# Altium project RECEPTOR_AIS.PrjPcb
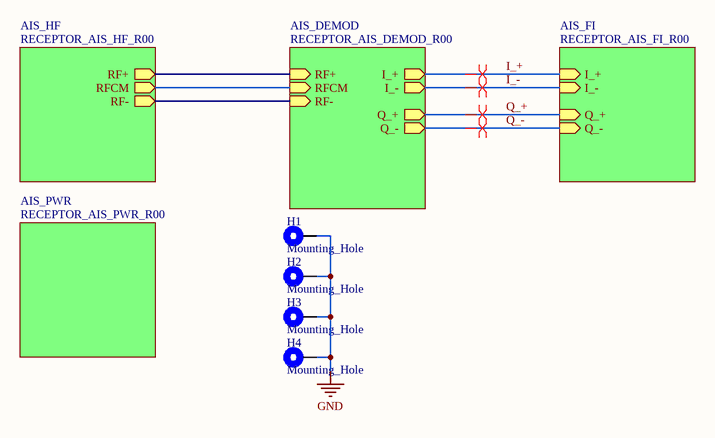
[diagram p0: RECEPTOR_AIS_BLK_R00.SchDoc]
5 sheets, 124 parts. Net scope: hierarchical (ports join the sheet entries above them; power ports are global).
Board file: Receptor_AIS_R00.PcbDoc
Sheets:
  RECEPTOR_AIS_BLK_R00.SchDoc
    AIS_HF = RECEPTOR_AIS_HF_R00.SchDoc
    AIS_DEMOD = RECEPTOR_AIS_DEMOD_R00.SchDoc
    AIS_FI = RECEPTOR_AIS_FI_R00.SchDoc
    AIS_PWR = RECEPTOR_AIS_PWR_R00.SchDoc

## Sheet RECEPTOR_AIS_BLK_R00.SchDoc
size A4; SheetNumber: 1; SheetTotal: 5

### Parts
H1  Mounting_Hole  [Mounting_Hole_M2]  (no BOM)
H2  Mounting_Hole  [Mounting_Hole_M2]  (no BOM)
H3  Mounting_Hole  [Mounting_Hole_M2]  (no BOM)
H4  Mounting_Hole  [Mounting_Hole_M2]  (no BOM)

### Sub-sheets
AIS_DEMOD = RECEPTOR_AIS_DEMOD_R00: RF- (in), RF+ (in), Q_+ (out), Q_- (out), RFCM (in), I_- (out), I_+ (out)
AIS_FI = RECEPTOR_AIS_FI_R00: I_+ (in), I_- (in), Q_+ (in), Q_- (in)
AIS_HF = RECEPTOR_AIS_HF_R00: RF+ (out), RF- (out), RFCM (out)
AIS_PWR = RECEPTOR_AIS_PWR_R00: no entries

### Nets
GND: H1.1 H2.1 H3.1 H4.1
I_+: sheet AIS_DEMOD/I_+, sheet AIS_FI/I_+
I_-: sheet AIS_DEMOD/I_-, sheet AIS_FI/I_-
Q_+: sheet AIS_DEMOD/Q_+, sheet AIS_FI/Q_+
Q_-: sheet AIS_DEMOD/Q_-, sheet AIS_FI/Q_-
RF+: sheet AIS_HF/RF+, sheet AIS_DEMOD/RF+
RF-: sheet AIS_HF/RF-, sheet AIS_DEMOD/RF-
RFCM: sheet AIS_HF/RFCM, sheet AIS_DEMOD/RFCM

### Layout directives
differential pair: I_+, I_-, Q_+, Q_-

## Sheet RECEPTOR_AIS_HF_R00.SchDoc
size A4; SheetNumber: 2; SheetTotal: 5
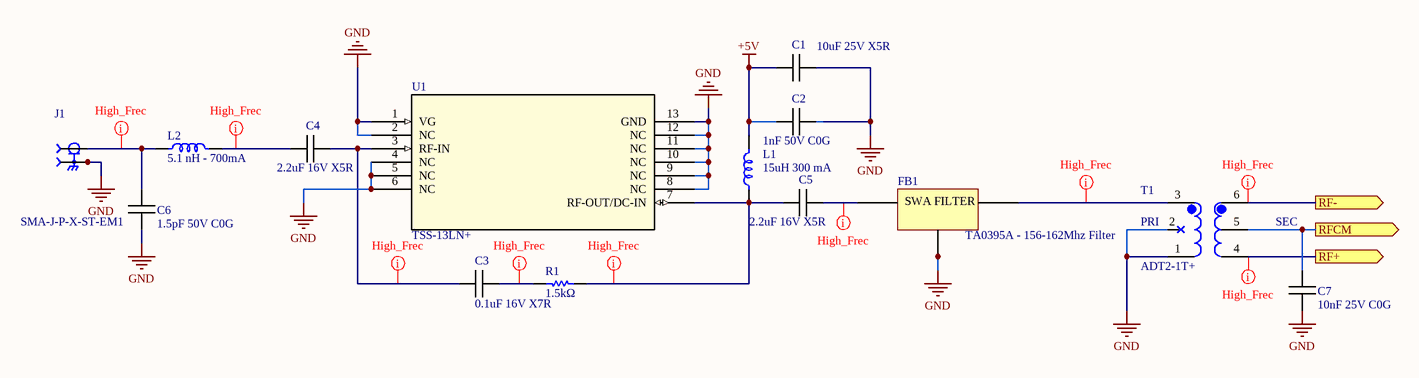
[diagram p1: RECEPTOR_AIS_HF_R00.SchDoc]

### Parts
C1  10uF 25V X5R  [C_0805]
C2  1nF 50V C0G  [C_0603]
C3  0.1uF 16V X7R  [C_0603]
C4  2.2uF 16V X5R  [C_0603]
C5  2.2uF 16V X5R  [C_0603]
C6  1.5pF 50V C0G  [C_0603]
C7  10nF 25V C0G  [C_0603]
FB1  TA0395A - 156-162Mhz Filter  [TA0395A]
J1  SMA-J-P-X-ST-EM1  [CONN_SMA-J-P-H-ST-EM1_SAI]
L1  15uH 300 mA  [IND_LQH32DN150K53L]
L2  5.1 nH - 700mA  [L_0603]
R1  1.5kΩ  [R_0603]
T1  ADT2-1T+  [CD542_MNC]
U1  TSS-13LN+  [TSS-13LN+]

### Ports
RF+ (out, see RECEPTOR_AIS_BLK_R00[2A], RECEPTOR_AIS_DEMOD_R00[2A]), RF- (out, see RECEPTOR_AIS_BLK_R00[2B], RECEPTOR_AIS_DEMOD_R00[2A]), RFCM (out, see RECEPTOR_AIS_BLK_R00[2B], RECEPTOR_AIS_DEMOD_R00[2A])

### Nets
+5V: C1.2 C2.1 L1.2
GND: C1.1 C2.2 C6.1 C7.1 FB1.1 FB1.3 FB1.4 FB1.5 FB1.6 FB1.8 FB1.9 FB1.10 J1.2 J1.3 T1.1 T1.2 U1.1(VG) U1.2(NC) U1.4(NC) U1.5(NC) U1.6(NC) U1.8(NC) U1.9(NC) U1.10(NC) U1.11(NC) U1.12(NC) U1.13(GND)
RF+: T1.4 ; port RF+
RF-: T1.6 ; port RF-
RFCM: C7.2 T1.5 ; port RFCM
NetC3_1: C3.1 C4.2 U1.3(RF-IN)
NetC3_2: C3.2 R1.2
NetC4_1: C4.1 L2.2
NetC5_1: C5.1 L1.1 R1.1 U1.7(RF-OUT/DC-IN)
NetC5_2: C5.2 FB1.7
NetC6_2: C6.2 J1.1 L2.1
NetFB1_2: FB1.2 T1.3

### Layout directives
net class RF_50Ohm: NetC3_1, NetC3_2, NetC4_1, NetC5_1, NetC5_2, NetC6_2, NetFB1_2, RF+, RF-

### Notes on the sheet
- (in symbol ADT2-1T+) PRI; SEC
- (in symbol TA0395A) SWA FILTER

### Library data of the parts
C1 = Capacitor NP: 10 µF ±10% 25V Ceramic Capacitor X5R 0805 (2012 Metric)
C2 = Capacitor NP: 1000 pF ±5% 50V Ceramic Capacitor C0G, NP0 0603 (1608 Metric)
C3 = Capacitor NP: 0.1 µF ±10% 16V Ceramic Capacitor X7R 0603 (1608 Metric)
C4 C5 = Capacitor NP: 2.2 µF ±10% 16V Ceramic Capacitor X5R 0603 (1608 Metric)
C6 = Capacitor NP: 1.5 pF ±0.25pF 50V Ceramic Capacitor C0G, NP0 0603 (1608 Metric)
C7 = Capacitor NP: 10000 pF ±5% 25V Ceramic Capacitor C0G, NP0 0603 (1608 Metric)
FB1 = TA0395A: 159.1625MHz Frequency Wireless RF SAW Filter (Surface Acoustic Wave) 3.8dB 5.725MHz Bandwidth 10-SMD, No Lead
J1 = SMA-J-P-X-ST-EM1: SMA Connector Jack, Female Socket 50 Ohms Board Edge, Cutout; Surface Mount Solder; MF: Samtec; MP: SMA-J-P-H-ST-EM3; SnapEDA_Link: https://www.snapeda.com/parts/SMA-J-P-H-ST-EM3/Samtec+Inc./view-part/?ref=snap; Package: None; Value: *; Check_prices: https://www.snapeda.com/parts/SMA-J-P-H-ST-EM3/Samtec+Inc./view-part/?ref=eda
L1 = IND: LQH32DN150K53L - 15 µH Unshielded Drum Core, Wirewound Inductor 300 mA 754mOhm Max Nonstandard
L2 = IND: LQW18AS5N1J00D - 5.1 nH Unshielded Wirewound Inductor 700 mA 140mOhm Max 0603 (1608 Metric)
R1 = Res1: 1.5 kΩ ±1% 0.1W, 1/10W Chip Resistor 0603 (1608 Metric) Moisture Resistant Thick Film
T1 = ADT2-1T+: Description; Manufacturer_Name: Mini Circuits; Type: Balun; Copyright: Copyright (C) 2026 Ultra Librarian. All rights reserved.; Manufacturer_Part_Number: ADT2-1T+; RefDes: RefDes
U1 = TSS-13LN+: Description; Manufacturer_Name: Mini Circuits; Copyright: Copyright (C) 2025 Ultra Librarian. All rights reserved.; Manufacturer_Part_Number: TSS-13LN+; RefDes: RefDes; Type: Type

## Sheet RECEPTOR_AIS_DEMOD_R00.SchDoc
size A4; SheetNumber: 3; SheetTotal: 5
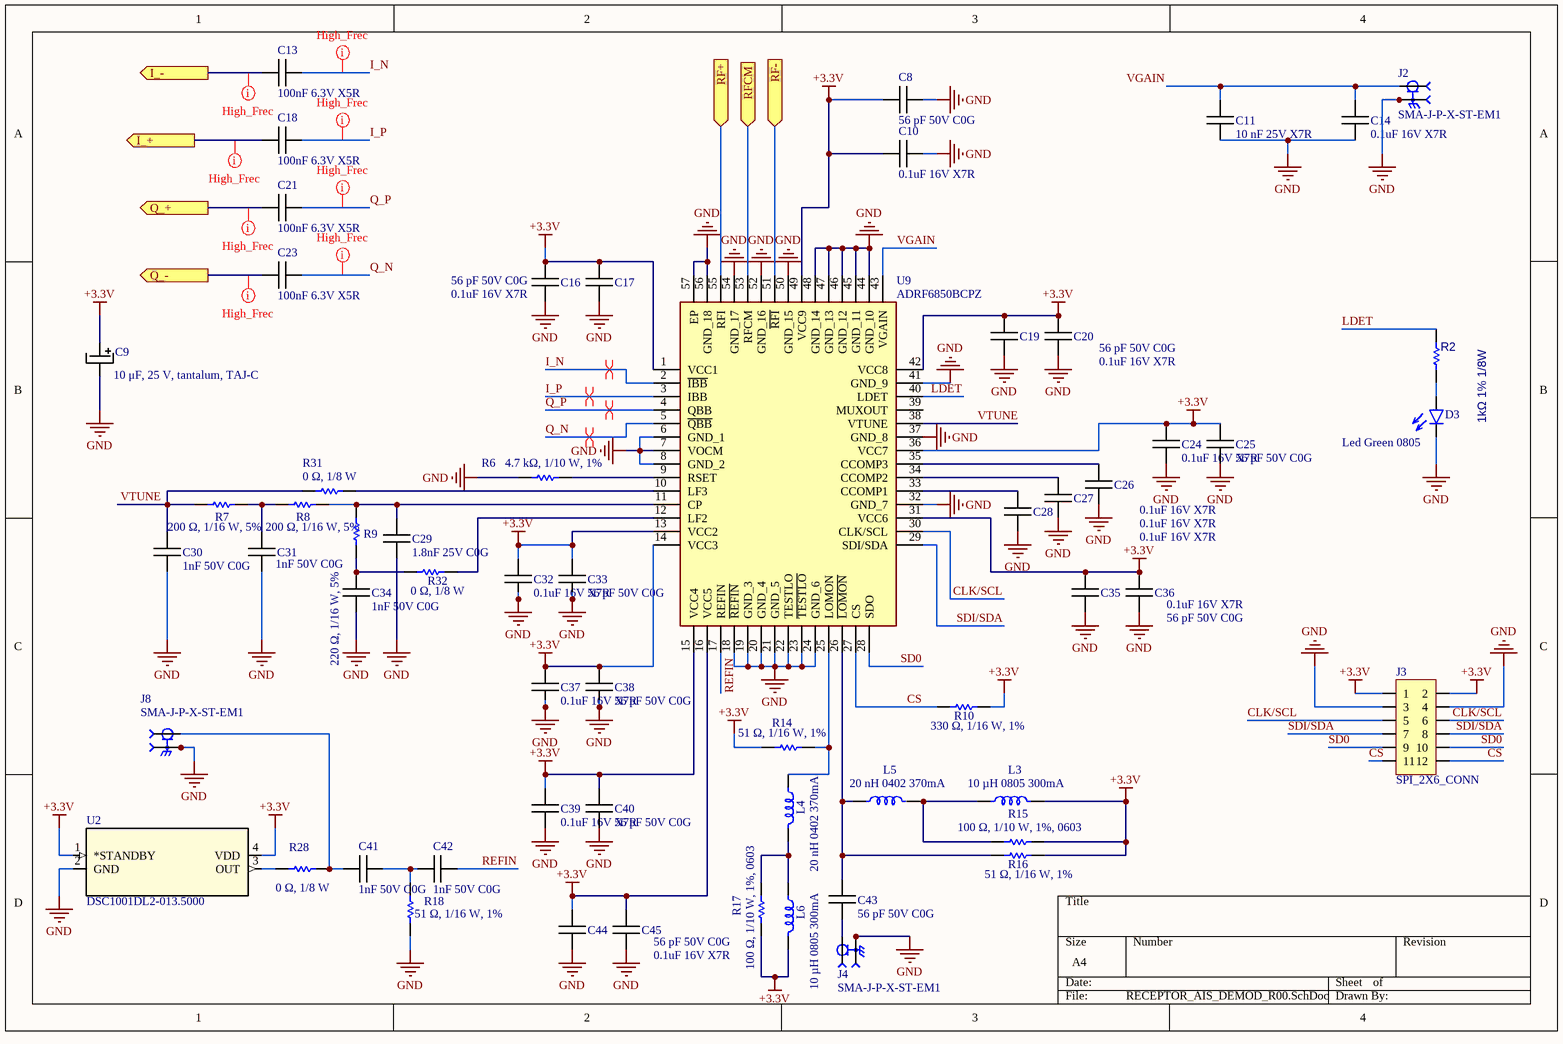
[diagram p2: RECEPTOR_AIS_DEMOD_R00.SchDoc]

### Parts
C8  56 pF 50V C0G  [C_0603]
C9  10 μF, 25 V, tantalum, TAJ-C  [TAJC_AVX-M]
C10  0.1uF 16V X7R  [C_0603]
C11  10 nF 25V X7R  [C_0603]
C13  100nF 6.3V X5R  [C_0603]
C14  0.1uF 16V X7R  [C_0603]
C16  0.1uF 16V X7R  [C_0603]
C17  56 pF 50V C0G  [C_0603]
C18  100nF 6.3V X5R  [C_0603]
C19  0.1uF 16V X7R  [C_0603]
C20  56 pF 50V C0G  [C_0603]
C21  100nF 6.3V X5R  [C_0603]
C23  100nF 6.3V X5R  [C_0603]
C24  0.1uF 16V X7R  [C_0603]
C25  56 pF 50V C0G  [C_0603]
C26  0.1uF 16V X7R  [C_0603]
C27  0.1uF 16V X7R  [C_0603]
C28  0.1uF 16V X7R  [C_0603]
C29  1.8nF 25V C0G  [C_0603]
C30  1nF 50V C0G  [C_0603]
C31  1nF 50V C0G  [C_0603]
C32  0.1uF 16V X7R  [C_0603]
C33  56 pF 50V C0G  [C_0603]
C34  1nF 50V C0G  [C_0603]
C35  0.1uF 16V X7R  [C_0603]
C36  56 pF 50V C0G  [C_0603]
C37  0.1uF 16V X7R  [C_0603]
C38  56 pF 50V C0G  [C_0603]
C39  0.1uF 16V X7R  [C_0603]
C40  56 pF 50V C0G  [C_0603]
C41  1nF 50V C0G  [C_0603]
C42  1nF 50V C0G  [C_0603]
C43  56 pF 50V C0G  [C_0603]
C44  0.1uF 16V X7R  [C_0603]
C45  56 pF 50V C0G  [C_0603]
D3  Led Green 0805  [LED_0805]
J2  SMA-J-P-X-ST-EM1  [CONN_SMA-J-P-H-ST-EM1_SAI]
J3  SPI_2X6_CONN  [Pin_Header_2x6]
J4  SMA-J-P-X-ST-EM1  [CONN_SMA-J-P-H-ST-EM1_SAI]
J8  SMA-J-P-X-ST-EM1  [CONN_SMA-J-P-H-ST-EM1_SAI]
L3  10 µH 0805 300mA  [L_0603]
L4  20 nH 0402 370mA  [L_0402]
L5  20 nH 0402 370mA  [L_0402]
L6  10 µH 0805 300mA  [L_0603]
R2  1kΩ 1% 1/8W  [R_0603]
R6  4.7 kΩ, 1/10 W, 1%  [R_0603]
R7  200 Ω, 1/16 W, 5%  [R_0603]
R8  200 Ω, 1/16 W, 5%  [R_0603]
R9  220 Ω, 1/16 W, 5%  [R_0603]
R10  330 Ω, 1/16 W, 1%  [R_0805]
R14  51 Ω, 1/16 W, 1%  [R_0805]
R15  100 Ω, 1/10 W, 1%, 0603  [R_0603]
R16  51 Ω, 1/16 W, 1%  [R_0805]
R17  100 Ω, 1/10 W, 1%, 0603  [R_0603]
R18  51 Ω, 1/16 W, 1%  [R_0805]
R28  0 Ω, 1/8 W  [R_0603]
R31  0 Ω, 1/8 W  [R_0603]
R32  0 Ω, 1/8 W  [R_0603]
U2  DSC1001DL2-013.5000  [CDFN4_2P5X2_MCH]
U9  ADRF6850BCPZ  [QFN50P800X800X100-57N-D]

### Ports
I_+ (out, see RECEPTOR_AIS_BLK_R00[3A], RECEPTOR_AIS_FI_R00[1B]), I_- (out, see RECEPTOR_AIS_BLK_R00[3B], RECEPTOR_AIS_FI_R00[1B]), Q_+ (out, see RECEPTOR_AIS_BLK_R00[3B], RECEPTOR_AIS_FI_R00[1C]), Q_- (out, see RECEPTOR_AIS_BLK_R00[3B], RECEPTOR_AIS_FI_R00[1C]), RF+ (in, see RECEPTOR_AIS_BLK_R00[2A], RECEPTOR_AIS_HF_R00[4C]), RF- (in, see RECEPTOR_AIS_BLK_R00[2B], RECEPTOR_AIS_HF_R00[4B]), RFCM (in, see RECEPTOR_AIS_BLK_R00[2B], RECEPTOR_AIS_HF_R00[4C])

### Nets
+3.3V: C8.1 C9.1 C10.1 C16.1 C17.1 C19.1 C20.1 C24.1 C25.1 C32.1 C33.1 C35.1 C36.1 C37.1 C38.1 C39.1 C40.1 C44.1 C45.1 J3.1 J3.2 L3.2 L6.2 R10.2 R14.2 R15.2 R16.2 R17.2 U2.1(*STANDBY) U2.4(VDD) U9.1(VCC1) U9.13(VCC2) U9.14(VCC3) U9.15(VCC4) U9.16(VCC5) U9.31(VCC6) U9.36(VCC7) U9.42(VCC8) U9.49(VCC9)
GND: C8.2 C9.2 C10.2 C11.2 C14.2 C16.2 C17.2 C19.2 C20.2 C24.2 C25.2 C26.2 C27.2 C28.2 C29.2 C30.2 C31.2 C32.2 C33.2 C34.2 C35.2 C36.2 C37.2 C38.2 C39.2 C40.2 C44.2 C45.2 D3.2(K) J2.2 J2.3 J3.3 J3.4 J4.2 J4.3 J8.2 J8.3 R6.2 R18.2 U2.2(GND) U9.6(GND_1) U9.7(VOCM) U9.8(GND_2) U9.18(~{REFIN}) U9.19(GND_3) U9.20(GND_4) U9.21(GND_5) U9.22(TESTLO) U9.23(~{TESTLO}) U9.24(GND_6) U9.32(GND_7) U9.37(GND_8) U9.41(GND_9) U9.44(GND_10) U9.45(GND_11) U9.46(GND_12) U9.47(GND_13) U9.48(GND_14) U9.50(GND_15) U9.52(GND_16) U9.54(GND_17) U9.56(GND_18) U9.57(EP)
CLK/SCL: J3.5 J3.6 U9.30(CLK/SCL)
CS: J3.11 J3.12 R10.1 U9.27(CS)
I_+: C18.2 ; port I_+
I_-: C13.2 ; port I_-
I_N: C13.1 U9.2(~{IBB})
I_P: C18.1 U9.3(IBB)
LDET: R2.2 U9.40(LDET)
Q_+: C21.2 ; port Q_+
Q_-: C23.2 ; port Q_-
Q_N: C23.1 U9.5(~{QBB})
Q_P: C21.1 U9.4(QBB)
REFIN: C42.1 U9.17(REFIN)
RF+: U9.55(RFI) ; port RF+
RF-: U9.51(~{RFI}) ; port RF-
RFCM: U9.53(RFCM) ; port RFCM
SD0: J3.9 J3.10 U9.28(SDO)
SDI/SDA: J3.7 J3.8 U9.29(SDI/SDA)
VGAIN: C11.1 C14.1 J2.1 U9.43(VGAIN)
VTUNE: C30.1 R7.2 R31.1 U9.38(VTUNE)
NetC26_1: C26.1 U9.35(CCOMP3)
NetC27_1: C27.1 U9.34(CCOMP2)
NetC28_1: C28.1 U9.33(CCOMP1)
NetC29_1: C29.1 R8.1 R9.1 U9.11(CP)
NetC31_1: C31.1 R7.1 R8.2
NetC34_1: C34.1 R9.2 R32.1
NetC41_1: C41.1 J8.1 R28.2
NetC41_2: C41.2 C42.2 R18.1
NetC43_1: C43.1 L5.1 R16.1 U9.26(~{LOMON})
NetC43_2: C43.2 J4.1
NetD3_1: D3.1(A) R2.1
NetL3_1: L3.1 L5.2 R15.1
NetL4_1: L4.1 R14.1 U9.25(LOMON)
NetL4_2: L4.2 L6.1 R17.1
NetR6_1: R6.1 U9.9(RSET)
NetR28_1: R28.1 U2.3(OUT)
NetR31_2: R31.2 U9.10(LF3)
NetR32_2: R32.2 U9.12(LF2)

Not connected (* = marked no-connect by the designer): U9 39(MUXOUT)

### Layout directives
net class RF_50Ohm: I_+, I_-, I_N, I_P, Q_+, Q_-, Q_N, Q_P
differential pair: I_N, I_P, Q_N, Q_P

### Library data of the parts
C8 C17 C20 C25 C33 C36 C38 C40 C43 C45 = Capacitor NP: 56 pF ±5% 50V Ceramic Capacitor C0G, NP0 0603 (1608 Metric)
C9 = Capacitor Pol: 10 µF Molded Tantalum Capacitors 25 V 2312 (6032 Metric) 1.8Ohm
C10 C14 C16 C19 C24 C26-C28 C32 C35 C37 C39 C44 = Capacitor NP: as C3 on sheet RECEPTOR_AIS_HF_R00
C11 = Capacitor NP: 10000 pF ±10% 25V Ceramic Capacitor X7R 0603 (1608 Metric)
C13 C18 C21 C23 = Capacitor NP: 0.1 µF ±10% 6.3V Ceramic Capacitor X5R 0603 (1608 Metric)
C29 = Capacitor NP: 1800 pF ±5% 25V Ceramic Capacitor C0G, NP0 0603 (1608 Metric)
C30 C31 C34 C41 C42 = Capacitor NP: as C2 on sheet RECEPTOR_AIS_HF_R00
D3 = Led: Green 569nm LED Indication - Discrete 2.1V 0805 (2012 Metric)
J2 J4 J8 = SMA-J-P-X-ST-EM1: as J1 on sheet RECEPTOR_AIS_HF_R00; SnapEDA_Link: https://www.snapeda.com/parts/SMA-J-P-H-ST-EM3/Samtec+Inc./view-part/?ref=snap; Package: None; Value: *; Check_prices: https://www.snapeda.com/parts/SMA-J-P-H-ST-EM3/Samtec+Inc./view-part/?ref=eda
J3 = SPI_2x6Pin_Connection
L3 L6 = IND: LQM18DN100M70L - 10 µH Shielded Multilayer Inductor 300 mA 1.365Ohm Max 0603 (1608 Metric)
L4 L5 = IND: LQW15AN20NJ00D - 20 nH Unshielded Wirewound Inductor 370 mA 270mOhm Max 0402 (1005 Metric)
R2 = Res1: 100 Ohms ±0.1% 1/8W Chip Resistor 0603 (1608 Metric) Thin Film
R6 = Res1: 4.7 kOhms ±1% 0.1W, 1/10W Chip Resistor 0603 (1608 Metric) Moisture Resistant Thick Film
R7 R8 = Res1: 200 Ohms ±5% 0.1W, 1/10W Chip Resistor 0603 (1608 Metric) Moisture Resistant Thick Film
R9 = Res1: 220 Ohms ±5% 0.1W, 1/10W Chip Resistor 0603 (1608 Metric) Moisture Resistant Thick Film
R10 = Res1: 330 Ohms ±1% 0.125W, 1/8W Chip Resistor 0805 (2012 Metric) Moisture Resistant Thick Film
R14 R16 R18 = Res1: CR0805-FX-51R0ELF - 51 Ohms ±1% 0.125W, 1/8W Chip Resistor 0805 (2012 Metric) Moisture Resistant Thick Film
R15 R17 = Res1: 100 Ohms ±1% 0.1W, 1/10W Chip Resistor 0603 (1608 Metric) Moisture Resistant Thick Film
R28 R31 R32 = Res1: CR0805-FX-51R0ELF - 0 Ohms Jumper 0.125W, 1/8W Chip Resistor 0603 (1608 Metric) Automotive AEC-Q200 Thick Film
U2 = DSC1001DL2-013.5000: 13.5 MHz XO (Standard) CMOS Oscillator 1.7V ~ 3.6V Standby (Power Down) 4-VDFN; Manufacturer_Name: Microchip; Copyright: Copyright (C) 2026 Ultra Librarian. All rights reserved.; Manufacturer_Part_Number: DSC1001DL2-013.5000; RefDes: RefDes; Type: Type
U9 = ADRF6850BCPZ: ADRF6850BCPZ, Demodulator Quadrature 250MHz 3.15  3.45 V 56-Pin LFCSP VQ; Manufacturer_Name: Analog Devices; Geometry.Height: 1mm; Mouser Part Number: 584-ADRF6850BCPZ; Mouser Price/Stock: https://www.mouser.co.uk/ProductDetail/Analog-Devices/ADRF6850BCPZ?qs=WIvQP4zGanhitN%252B3d2%252BYqw%3D%3D; Manufacturer_Part_Number: ADRF6850BCPZ; Datasheet Link: https://componentsearchengine.com/Datasheets/2/ADRF6850BCPZ.pdf

## Sheet RECEPTOR_AIS_FI_R00.SchDoc
size A4; SheetNumber: 4; SheetTotal: 5
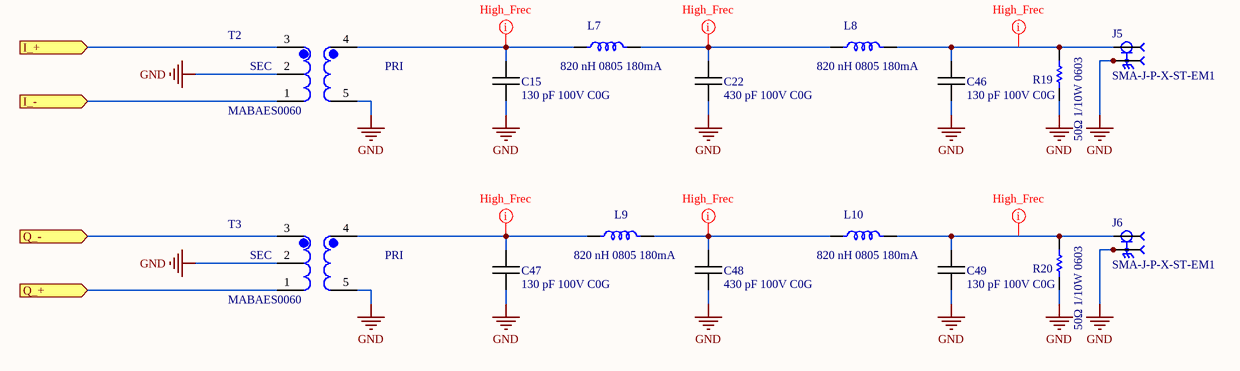
[diagram p3: RECEPTOR_AIS_FI_R00.SchDoc]

### Parts
C15  130 pF 100V C0G  [C_0603]
C22  430 pF 100V C0G  [C_0603]
C46  130 pF 100V C0G  [C_0603]
C47  130 pF 100V C0G  [C_0603]
C48  430 pF 100V C0G  [C_0603]
C49  130 pF 100V C0G  [C_0603]
J5  SMA-J-P-X-ST-EM1  [CONN_SMA-J-P-H-ST-EM1_SAI]
J6  SMA-J-P-X-ST-EM1  [CONN_SMA-J-P-H-ST-EM1_SAI]
L7  820 nH 0805 180mA  [L_0805]
L8  820 nH 0805 180mA  [L_0805]
L9  820 nH 0805 180mA  [L_0805]
L10  820 nH 0805 180mA  [L_0805]
R19  50Ω 1/10W 0603  [R_0603]
R20  50Ω 1/10W 0603  [R_0603]
T2  MABAES0060  [MABAES0060_MCM]
T3  MABAES0060  [MABAES0060_MCM]

### Ports
I_+ (in, see RECEPTOR_AIS_BLK_R00[3A], RECEPTOR_AIS_DEMOD_R00[1A]), I_- (in, see RECEPTOR_AIS_BLK_R00[3B], RECEPTOR_AIS_DEMOD_R00[1A]), Q_+ (in, see RECEPTOR_AIS_BLK_R00[3B], RECEPTOR_AIS_DEMOD_R00[1A]), Q_- (in, see RECEPTOR_AIS_BLK_R00[3B], RECEPTOR_AIS_DEMOD_R00[1B])

### Nets
GND: C15.1 C22.1 C46.1 C47.1 C48.1 C49.1 J5.2 J5.3 J6.2 J6.3 R19.1 R20.1 T2.2 T2.5 T3.2 T3.5
I_+: T2.3 ; port I_+
I_-: T2.1 ; port I_-
Q_+: T3.1 ; port Q_+
Q_-: T3.3 ; port Q_-
NetC15_2: C15.2 L7.1 T2.4
NetC22_2: C22.2 L7.2 L8.1
NetC46_2: C46.2 J5.1 L8.2 R19.2
NetC47_2: C47.2 L9.1 T3.4
NetC48_2: C48.2 L9.2 L10.1
NetC49_2: C49.2 J6.1 L10.2 R20.2

### Layout directives
net class RF_50Ohm: NetC15_2, NetC22_2, NetC46_2, NetC47_2, NetC48_2, NetC49_2

### Notes on the sheet
- (in symbol MABAES0060) SEC; PRI

### Library data of the parts
C15 C46 C47 C49 = Capacitor NP: 130 pF ±1% 100V Ceramic Capacitor C0G, NP0 0603 (1608 Metric)
C22 C48 = Capacitor NP: 430 pF ±5% 100V Ceramic Capacitor C0G, NP0 0603 (1608 Metric)
J5 J6 = SMA-J-P-X-ST-EM1: as J1 on sheet RECEPTOR_AIS_HF_R00; SnapEDA_Link: https://www.snapeda.com/parts/SMA-J-P-H-ST-EM3/Samtec+Inc./view-part/?ref=snap; Package: None; Value: *; Check_prices: https://www.snapeda.com/parts/SMA-J-P-H-ST-EM3/Samtec+Inc./view-part/?ref=eda
L7-L10 = IND: FIXED IND 820NH 180MA 2.35 OHM
R19 R20 = Res1: 50 Ohms ±0.1% 0.1W, 1/10W Chip Resistor 0603 (1608 Metric) Thin Film
T2 T3 = MABAES0060: RF Balun 300kHz ~ 200MHz 1:1 6-SMD (5 Leads), Flat Lead; MF: Mini-Circuits; MP: ADT1-6T+; SnapEDA_Link: https://www.snapeda.com/parts/ADT1-6T+/Mini-Circuits/view-part/?ref=snap; Package: SMD-6 Mini-Circuits; Value: *; Check_prices: https://www.snapeda.com/parts/ADT1-6T+/Mini-Circuits/view-part/?ref=eda

## Sheet RECEPTOR_AIS_PWR_R00.SchDoc
size A4; SheetNumber: 5; SheetTotal: 5
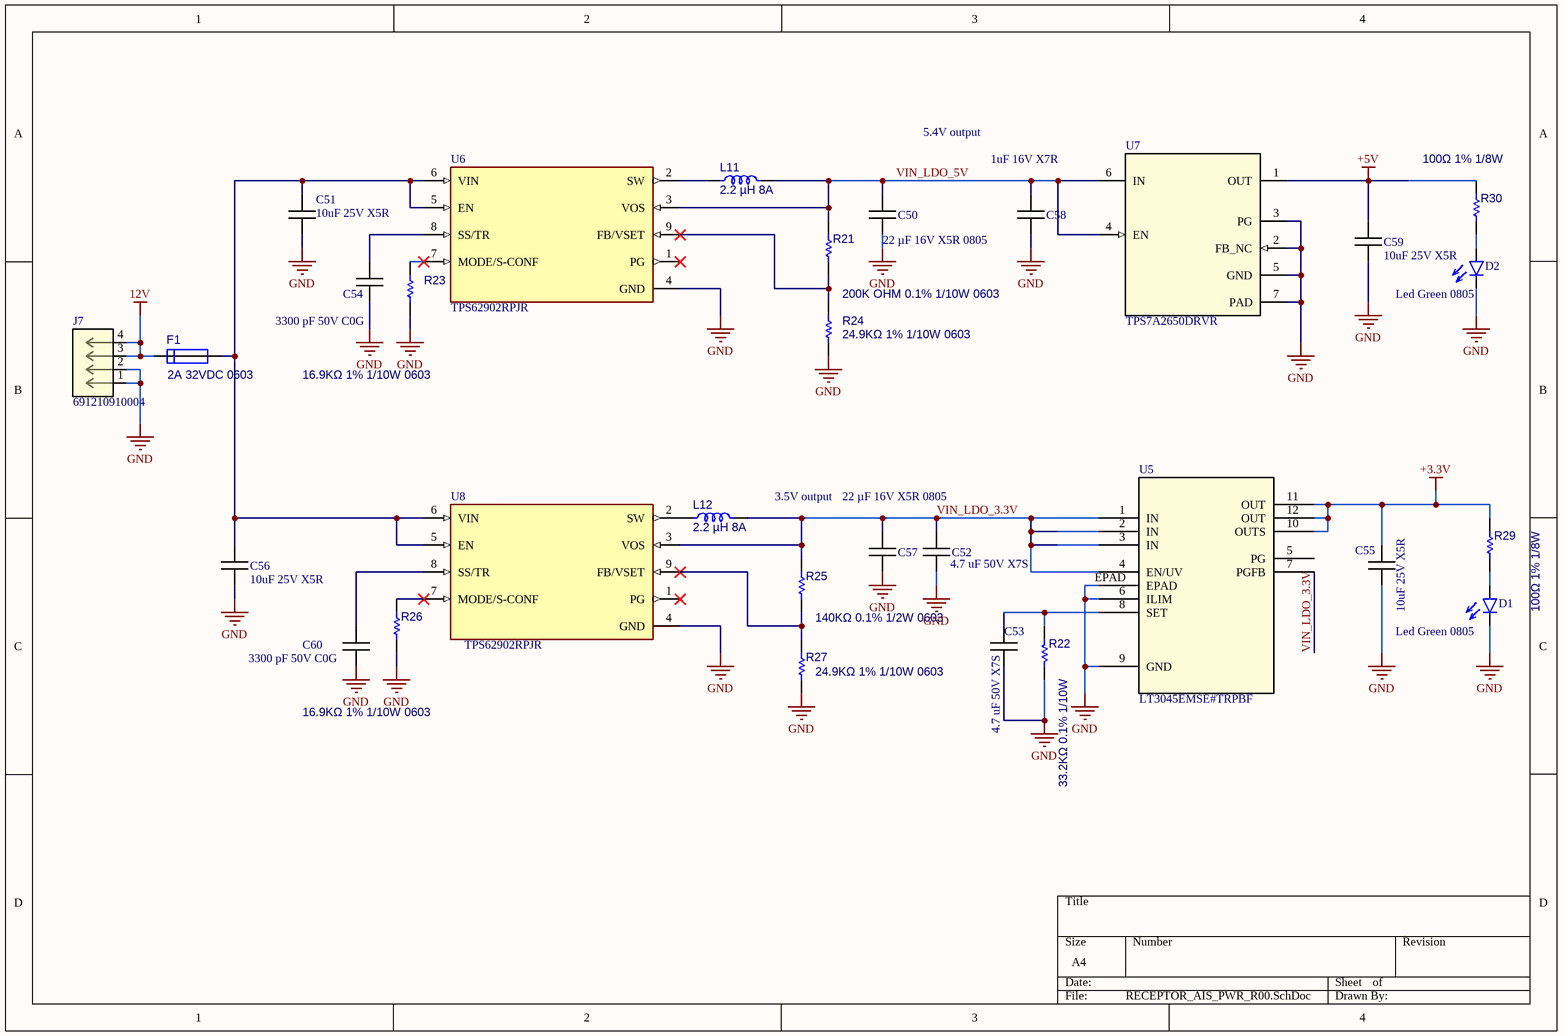
[diagram p4: RECEPTOR_AIS_PWR_R00.SchDoc]

### Parts
C50  22 µF 16V X5R 0805  [C_0805]
C51  10uF 25V X5R  [C_0805]
C52  4.7 uF 50V X7S  [C_0805]
C53  4.7 uF 50V X7S  [C_0805]
C54  3300 pF 50V C0G  [C_0603]
C55  10uF 25V X5R  [C_0805]
C56  10uF 25V X5R  [C_0805]
C57  22 µF 16V X5R 0805  [C_0805]
C58  1uF 16V X7R  [C_0603]
C59  10uF 25V X5R  [C_0805]
C60  3300 pF 50V C0G  [C_0603]
D1  Led Green 0805  [LED_0805]
D2  Led Green 0805  [LED_0805]
F1  2A 32VDC 0603  [0603_AVX-M]
J7  691210910004  [691210910004]
L11  2.2 µH 8A  [INDPM6965X240N]
L12  2.2 µH 8A  [INDPM6965X240N]
R21  200K OHM 0.1% 1/10W 0603  [R_0603]
R22  33.2KΩ 0.1% 1/10W  [R_0603]
R23  16.9KΩ 1% 1/10W 0603  [R_0603]
R24  24.9KΩ 1% 1/10W 0603  [R_0603]
R25  140KΩ 0.1% 1/2W 0603  [R_0603]
R26  16.9KΩ 1% 1/10W 0603  [R_0603]
R27  24.9KΩ 1% 1/10W 0603  [R_0603]
R29  100Ω 1% 1/8W  [R_0603]
R30  100Ω 1% 1/8W  [R_0603]
U5  LT3045EMSE#TRPBF  [12-MSOP-EP]
U6  TPS62902RPJR  [FP-RPJ0009A-MFG]
U7  TPS7A2650DRVR  [DRV0006A_NV]
U8  TPS62902RPJR  [FP-RPJ0009A-MFG]

### Nets
12V: F1.1 J7.3 J7.4
+3.3V: C55.2 R29.2 U5.10(OUTS) U5.11(OUT) U5.12(OUT)
+5V: C59.2 R30.2 U7.1(OUT)
GND: C50.1 C51.1 C52.1 C53.1 C54.1 C55.1 C56.1 C57.1 C58.1 C59.1 C60.1 D1.2(K) D2.2(K) J7.1 J7.2 R22.1 R23.1 R24.1 R26.1 R27.1 U5.6(ILIM) U5.9(GND) U5.EPAD U6.4(GND) U7.2(FB_NC) U7.3(PG) U7.5(GND) U7.7(PAD) U8.4(GND)
VIN_LDO_3.3V: C52.2 C57.2 L12.2 R25.2 U5.1(IN) U5.2(IN) U5.3(IN) U5.4(EN/UV) U5.7(PGFB) U8.3(VOS)
VIN_LDO_5V: C50.2 C58.2 L11.2 R21.2 U6.3(VOS) U7.4(EN) U7.6(IN)
NetC51_2: C51.2 C56.2 F1.2 U6.5(EN) U6.6(VIN) U8.5(EN) U8.6(VIN)
NetC53_2: C53.2 R22.2 U5.8(SET)
NetC54_2: C54.2 U6.8(SS/TR)
NetC60_2: C60.2 U8.8(SS/TR)
NetD1_1: D1.1(A) R29.1
NetD2_1: D2.1(A) R30.1
NetL11_1: L11.1 U6.2(SW)
NetL12_1: L12.1 U8.2(SW)
NetR21_1: R21.1 R24.2 U6.9(FB/VSET)
NetR23_2: R23.2 U6.7(MODE/S-CONF)
NetR25_1: R25.1 R27.2 U8.9(FB/VSET)
NetR26_2: R26.2 U8.7(MODE/S-CONF)

Not connected (* = marked no-connect by the designer): U5 5(PG); U6 1(PG)*; U8 1(PG)*

### Notes on the sheet
- 5.4V output
- 3.5V output

### Library data of the parts
C50 C57 = Capacitor NP: 22 µF ±20% 16V Ceramic Capacitor X5R 0805 (2012 Metric)
C51 C55 C56 C59 = Capacitor NP: as C1 on sheet RECEPTOR_AIS_HF_R00
C52 C53 = Capacitor NP: 4.7 µF ±10% 50V Ceramic Capacitor X7S 0805 (2012 Metric)
C54 C60 = Capacitor NP: 3300 pF ±1% 50V Ceramic Capacitor C0G, NP0 0603 (1608 Metric)
C58 = Capacitor NP: 1 µF ±5% 16V Ceramic Capacitor X7R 0603 (1608 Metric)
D1 D2 = Led: as D3 on sheet RECEPTOR_AIS_DEMOD_R00
F1 = FUSIBLE: 2 A 32 V Fuse Board Mount (Cartridge Style Excluded) Surface Mount 0603 (1608 Metric)
J7 = Conn_1x4_WE: WR-TBL Terminal block - Screwless Push IN - THT; Manufacturer_Name: Wurth Electronics; Manufacturer_Part_Number: 691412320004; Copyright: Copyright (C) 2025 Ultra Librarian. All rights reserved.; RefDes: RefDes; Type: Type
L11 L12 = IND: IHLP2525CZER2R2M01 - 2.2 µH Shielded Molded Inductor 8 A 20mOhm Max Nonstandard
R21 = Res1: 200 kOhms ±0.1% 0.1W, 1/10W Chip Resistor 0603 (1608 Metric) Thin Film
R22 = Res1: 33.2 kOhms ±0.1% 0.1W, 1/10W Chip Resistor 0603 (1608 Metric) Thin Film
R23 R26 = Res1: 16.9 kOhms ±0.1% 0.1W, 1/10W Chip Resistor 0603 (1608 Metric) Thin Film
R24 R27 = Res1: 24.9 kOhms ±0.1% 0.1W, 1/10W Chip Resistor 0603 (1608 Metric) Thin Film
R25 = Res1: 140 kOhms ±1% 0.5W, 1/2W Chip Resistor 0603 (1608 Metric) Automotive AEC-Q200, Pulse Withstanding Thick Film
R29 R30 = Res1: as R2 on sheet RECEPTOR_AIS_DEMOD_R00
U5 = LT3045EMSETRPBF: 20V, 500mA, Ultralow Noise, Ultrahigh PSRR Linear Regulator; Manufacturer_Name: Analog Devices Inc; Copyright: Copyright (C) 2026 Ultra Librarian. All rights reserved.; Manufacturer_Part_Number: LT3045EMSE#TRPBF; RefDes: RefDes; Type: Type
U6 U8 = TPS62902RPJR: TPS62902RPJR 3-V TO 17-V, 2-A, HIGH-EFFICIENC; Manufacturer Part Number: TPS62902RPJR
U7 = TPS7A2650DRVR: 500-mA, 18-V, ultra-low-IQ, high-accuracy, adjustable low-dropout voltage regulator with power good 6-WSON -40 to 125; Manufacturer_Name: Texas Instruments; TYPE: TYPE; RefDes: RefDes; Copyright: Copyright (C) 2025 Ultra Librarian. All rights reserved.; Manufacturer_Part_Number: TPS7A2650DRVR

## Nets that join several sheets
+3.3V: RECEPTOR_AIS_DEMOD_R00 (39 pins), RECEPTOR_AIS_PWR_R00 (5 pins)
+5V: RECEPTOR_AIS_HF_R00 (C1.2 C2.1 L1.2), RECEPTOR_AIS_PWR_R00 (C59.2 R30.2 U7.1)
GND: RECEPTOR_AIS_BLK_R00 (H1.1 H2.1 H3.1 H4.1), RECEPTOR_AIS_HF_R00 (27 pins), RECEPTOR_AIS_DEMOD_R00 (63 pins), RECEPTOR_AIS_FI_R00 (16 pins), RECEPTOR_AIS_PWR_R00 (29 pins)
I_+: RECEPTOR_AIS_DEMOD_R00 (C18.2), RECEPTOR_AIS_FI_R00 (T2.3)
I_-: RECEPTOR_AIS_DEMOD_R00 (C13.2), RECEPTOR_AIS_FI_R00 (T2.1)
Q_+: RECEPTOR_AIS_DEMOD_R00 (C21.2), RECEPTOR_AIS_FI_R00 (T3.1)
Q_-: RECEPTOR_AIS_DEMOD_R00 (C23.2), RECEPTOR_AIS_FI_R00 (T3.3)
RF+: RECEPTOR_AIS_HF_R00 (T1.4), RECEPTOR_AIS_DEMOD_R00 (U9.55)
RF-: RECEPTOR_AIS_HF_R00 (T1.6), RECEPTOR_AIS_DEMOD_R00 (U9.51)
RFCM: RECEPTOR_AIS_HF_R00 (C7.2 T1.5), RECEPTOR_AIS_DEMOD_R00 (U9.53)